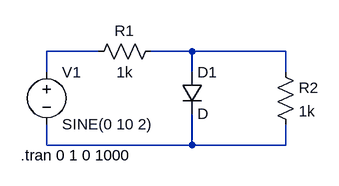
[diagram p0: schematic zener.asc]
zener.asc, the LTspice schematic file:
Version 4.1
SHEET 1 880 680
WIRE 128 64 48 64
WIRE 272 64 208 64
WIRE 416 64 272 64
WIRE 48 96 48 64
WIRE 272 96 272 64
WIRE 416 96 416 64
WIRE 48 208 48 176
WIRE 272 208 272 160
WIRE 272 208 48 208
WIRE 416 208 416 176
WIRE 416 208 272 208
SYMBOL voltage 48 80 R0
WINDOW 123 0 0 Left 0
WINDOW 39 0 0 Left 0
SYMATTR InstName V1
SYMATTR Value SINE(0 10 2)
SYMBOL res 224 48 R90
WINDOW 0 0 56 VBottom 2
WINDOW 3 32 56 VTop 2
SYMATTR InstName R1
SYMATTR Value 1k
SYMBOL res 400 80 R0
SYMATTR InstName R2
SYMATTR Value 1k
SYMBOL diode 256 96 R0
SYMATTR InstName D1
TEXT 8 224 Left 2 !.tran 0 1 0 1000

The netlist it stands for:
* zener.asc
V1 N001 N003 SINE(0 10 2)
R1 N002 N001 1k
R2 N002 N003 1k
D1 N002 N003 D
.model D D
.lib standard.dio
.tran 0 1 0 1000
.backanno
.end